# Altium schematic sheet ESP.SchDoc: Płytka rozwojowa STM
size A4; Author1: Łukasz Wawrzyniak; Organization: Politechnika Łódzka; Address1: WEEIA; Address2: Elektronika i Telekomunikacja; Address3: Semestr zimowy 2021/2022; Address4: Stopień II; Revision: -; SheetNumber: 6; SheetTotal: 7; Author2: Mateusz Melka; Title2: Zaawansowane narzędzia CAD/EDA; Author5: Maciej Figiel; Author4: Michał Skurpel; Author3: Jakub Korzeniowski; Index1: 239499; Index2: 239488; Index3: 239436; Index4: 239457; Index5: 239473
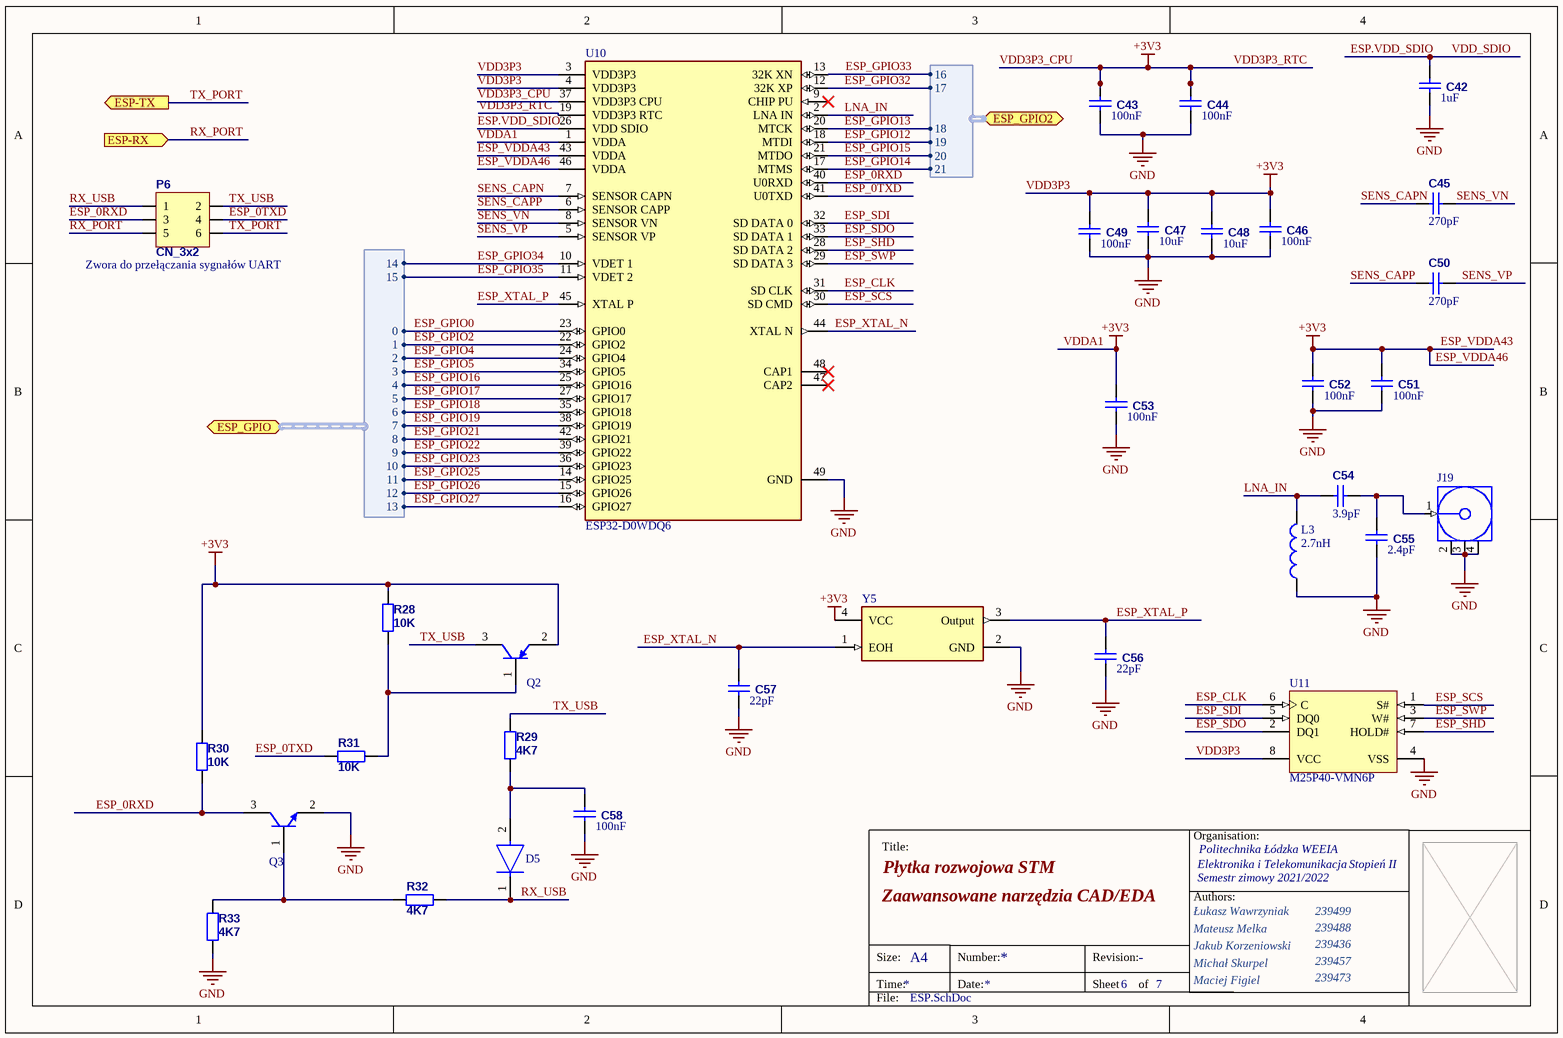
[diagram p0: ESP.SchDoc]

## Parts
C42  1uF  [0805]
C43  100nF  [0805]
C44  100nF  [0805]
C45  270pF  [0805]
C46  100nF  [0805]
C47  10uF  [0805]
C48  10uF  [0805]
C49  100nF  [0805]
C50  270pF  [0805]
C51  100nF  [0805]
C52  100nF  [0805]
C53  100nF  [0805]
C54  3.9pF  [0805]
C55  2.4pF  [0805]
C56  22pF  [0805]
C57  22pF  [0805]
C58  100nF  [0805]
D5  TME@1N4148WS  [FP-477AB-IPC_C]  (value not drawn)
J19  TME@908-22101T  [AMPH-908-22101_V]  (value not drawn)
L3  value 2.7nH  [0402-A]  (hidden comment: TME@0402AS-2N7K-08)
P6  CN_3x2  [GP_3x2]
Q2  TME@2SA1774G  [ONSC-SC-75-3-463-01_V]  (value not drawn)
Q3  TME@BC847ALT1G  [ONSC-SOT-23-3-318-08_V]  (value not drawn)
R28  10K  [0805]
R29  4K7  [0805]
R30  10K  [0805]
R31  10K  [0805]
R32  4K7  [0805]
R33  4K7  [0805]
U10  ESP32-D0WDQ6  [FP-ESP32-D0WDQ6-IPC_C]
U11  M25P40-VMN6P  [MICT-MN-8_N]
Y5  625L3C040M00000  [FP-625-MFG]  (value not drawn)

## Ports
ESP-RX (in), ESP-TX (out), ESP_GPIO2 (bidir, harness GPIO ESP2), ESP_GPIO (bidir, harness GPIO ESP)

## Harnesses
GPIO ESP: 0, 1, 2, 3, 4, 5, 6, 7, 8, 9, 10, 11, 12, 13, 14, 15
GPIO ESP2: 16, 17, 18, 19, 20, 21

## Nets
ESP_VDDA43: C43.2 C44.2 C46.2 C47.2 C48.2 C49.2 C51.2 C52.2 C53.2 Q2.2(E) R28.1 R30.1 U10.1(VDDA) U10.3(VDD3P3) U10.4(VDD3P3) U10.19(VDD3P3_RTC) U10.37(VDD3P3_CPU) U10.43(VDDA) U10.46(VDDA) U11.8(VCC) Y5.4(VCC)  [also labelled +3V3, ESP_VDDA46, VDD3P3, VDD3P3_CPU, VDD3P3_RTC, VDDA1]
GND: C42.1 C43.1 C44.1 C46.1 C47.1 C48.1 C49.1 C51.1 C52.1 C53.1 C55.1 C56.1 C57.1 C58.1 J19.2(GND) J19.3(GND) J19.4(GND) L3.1 Q3.2(E) R33.2 U10.49(GND) U11.4(VSS) Y5.2(GND)
ESP.VDD_SDIO: C42.2 U10.26(VDD_SDIO)  [also labelled VDD_SDIO]
ESP_0RXD: P6.3 Q3.3(C) R30.2 U10.40(U0RXD)
ESP_0TXD: P6.4 R31.1 U10.41(U0TXD)
ESP_CLK: U10.31(SD_CLK) U11.6(C)
ESP_GPIO0: U10.23(GPIO0) ; port ESP_GPIO.0
ESP_GPIO2: U10.22(GPIO2) ; port ESP_GPIO.1
ESP_GPIO4: U10.24(GPIO4) ; port ESP_GPIO.2
ESP_GPIO5: U10.34(GPIO5) ; port ESP_GPIO.3
ESP_GPIO12: U10.18(MTDI) ; port ESP_GPIO2.19
ESP_GPIO13: U10.20(MTCK) ; port ESP_GPIO2.18
ESP_GPIO14: U10.17(MTMS) ; port ESP_GPIO2.21
ESP_GPIO15: U10.21(MTDO) ; port ESP_GPIO2.20
ESP_GPIO16: U10.25(GPIO16) ; port ESP_GPIO.4
ESP_GPIO17: U10.27(GPIO17) ; port ESP_GPIO.5
ESP_GPIO18: U10.35(GPIO18) ; port ESP_GPIO.6
ESP_GPIO19: U10.38(GPIO19) ; port ESP_GPIO.7
ESP_GPIO21: U10.42(GPIO21) ; port ESP_GPIO.8
ESP_GPIO22: U10.39(GPIO22) ; port ESP_GPIO.9
ESP_GPIO23: U10.36(GPIO23) ; port ESP_GPIO.10
ESP_GPIO25: U10.14(GPIO25) ; port ESP_GPIO.11
ESP_GPIO26: U10.15(GPIO26) ; port ESP_GPIO.12
ESP_GPIO27: U10.16(GPIO27) ; port ESP_GPIO.13
ESP_GPIO32: U10.12(32K_XP) ; port ESP_GPIO2.17
ESP_GPIO33: U10.13(32K_XN) ; port ESP_GPIO2.16
ESP_GPIO34: U10.10(VDET_1) ; port ESP_GPIO.14
ESP_GPIO35: U10.11(VDET_2) ; port ESP_GPIO.15
ESP_SCS: U10.30(SD_CMD) U11.1(S#)
ESP_SDI: U10.32(SD_DATA_0) U11.5(DQ0)
ESP_SDO: U10.33(SD_DATA_1) U11.2(DQ1)
ESP_SHD: U10.28(SD_DATA_2) U11.7(HOLD#)
ESP_SWP: U10.29(SD_DATA_3) U11.3(W#)
ESP_XTAL_N: C57.2 U10.44(XTAL_N) Y5.1(EOH)
ESP_XTAL_P: C56.2 U10.45(XTAL_P) Y5.3(Output)
LNA_IN: C54.2 L3.2 U10.2(LNA_IN)
RX_PORT: P6.5 ; port ESP-RX
RX_USB: D5.1(C) P6.1 R32.2
SENS_CAPN: C45.2 U10.7(SENSOR_CAPN)
SENS_CAPP: C50.2 U10.6(SENSOR_CAPP)
SENS_VN: C45.1 U10.8(SENSOR_VN)
SENS_VP: C50.1 U10.5(SENSOR_VP)
TX_PORT: P6.6 ; port ESP-TX
TX_USB: P6.2 Q2.3(C) R29.1
NetC54_1: C54.1 C55.2 J19.1(SIGNAL)
NetC58_2: C58.2 D5.2(A) R29.2
NetQ2_1: Q2.1(B) R28.2 R31.2
NetQ3_1: Q3.1(B) R32.1 R33.1

Not connected (* = marked no-connect by the designer): U10 9(CHIP_PU)* 47(CAP2)* 48(CAP1)*

## Notes on the sheet
- (near P6) Zwora do przełączania sygnałów UART
- Title:
- Organisation:
- Authors:
- Size:
- Time:
- A4
- Number:
- Date:
- Revision:
- Sheet
- of
- File:

## Library data of the parts
C42 C45 C47 C48 C50 C54-C57 = Cap: Ceramic capacitor MLCC SMD ±1%; Value: 100nF; ComponentLink1Description: datasheet; ComponentLink2Description: supplier
C43 C44 C46 C49 C51-C53 C58 = Cap: Ceramic capacitor MLCC SMD ±1%; ComponentLink1Description: datasheet; ComponentLink2Description: supplier; Value: 100nF
D5 = CMP-07163-000040-1: DIODE GEN PURP 75V 150MA SOD323F; Forward Voltage: 1V; Power Dissipation: 200mW; Element Configuration: Single; Max Forward Surge Current (Ifsm): 2A; Peak Reverse Current: 5uA; Recovery Time: 4ns; Package Quantity: 1; Number of Pins: 2; Height: 1mm; REACH SVHC: No SVHC; Max Reverse Voltage (DC): 75V; Forward Current: 150mA; Length: 1.8mm; Max Repetitive Reverse Voltage (Vrrm): 75V; Max Operating Temperature: 150°C; Average Rectified Current: 150mA; Contact Plating: Tin; Packaging: Tape and Reel; Radiation Hardening: No; Min Operating Temperature: -55°C; Width: 1.35mm; Weight: 0.0276g; Lead Free: Lead Free; Mount: Surface Mount; Reverse Voltage: 75V; Reverse Recovery Time: 4ns; ComponentLink1Description: TME; ComponentLink1URL: https://www.tme.eu/en/details/1n4148ws/smd-universal-diodes/onsemi/
J19 = CMP-2000-05707-1: Female MMCX Connector, 1 Position, Height 3.607 mm, -40 to 90 degC, RoHS, Bulk; Manufacturer: Amphenol; Impedance: 50Ohm; Body Material: BerylliumCopper; Shield Termination: Solder; Body Finish: Gold; Frequency - Max: 6GHz; Connector Type: Jack,FemaleSocket; Other Names: 90822101ARF1724; Dielectric Material: LiquidCrystalPolymer(LCP); Online Catalog: MMCX,MicroMate™Series; 3D Model: 908-22101.igs; Fastening Type: Snap-On; Connector Style: MMCX; Standard Package: 1; Manufacturer URL: http://www.amphenol.com/; Series: MicroMate™; Mounting Type: SurfaceMount; Housing Color: Black; Operating Temperature: -55°C~155°C; Package Reference: 908-22101; Packaging: Bulk; Voltage Rating: -; Cable Group: -; Features: -; Datasheet URL: http://www.amphenolrf.com/downloads/dl/file/id/2664/product/2399/908_22101_customer_drawing.pdf; Center Contact Material: BerylliumCopper; Package Description: Female MMCX Connector, 1 Position, Height 3.607 mm; Center Contact Plating: Gold; Category: Connectors,Interconnects; Mounting Technology: SurfaceMount; Contact Termination: Solder; Ingress Protection: -; Datasheet Version: Rev. A, 05/1997; Family: CoaxialConnectors(RF); ComponentLink1Description: TME; ComponentLink1URL: https://www.tme.eu/pl/details/908-22101t/zlacza-mcx-mmcx/amphenol-icc/
L3 = Inductor: 0402; Code_IEC: 1005; Published: 8-Jun-2000; LatestRevisionDate: 29-May-2009; LatestRevisionNote: IPC-7351 Footprint Added.; PackageReference: 0402-A; Publisher: Altium Limited; PackageDescription: Chip Inductor; Code_JEITA: 0402; ComponentLink1Description: New link; ComponentLink1URL: https://www.tme.eu/pl/details/0402as-2n7k-08/dlawiki-smd-0402/fastron/
Q2 = CMP-1048-00415-1: PNP Silicon General Purpose Amplifier Transistor, 3-Pin SC-75, Pb-Free, Tape and Reel; Manufacturer: On Semiconductor; IC Continuous (A): -0.1; ComponentLink2URL: http://www.onsemi.com/pub_link/Collateral/2SA1774-D.PDF; Mounting Technology: Surface Mount; PartNumber: 2SA1774G; ComponentLink2Description: Datasheet; PackageDescription: 3-Pin Small Outline Transistor, Body 1.6 x 0.8 mm, Pitch 0.5 mm; RoHS: TRUE; Packing: Tape and Reel; PackageVersion: Rev. F, 07/2005; ComponentLink1URL: http://www.onsemi.com/; ComponentLink3Description: Package Specification; ComponentLink3URL: http://www.onsemi.com/pub_link/Collateral/463-01.PDF; ComponentLink1Description: Manufacturer URL; Polarity: PNP; DatasheetVersion: Rev. 9; PackageReference: SC-75-3-463-01; ComponentLink4Description: TME; ComponentLink4URL: https://www.tme.eu/en/details/2sa1774g/pnp-smd-transistors/onsemi/
Q3 = CMP-1048-00763-1: General Purpose Transistor, NPN Silicon, 3-Pin SOT-23, Pb-Free, Tape and Reel; Manufacturer: On Semiconductor; IC Continuous (A): 0.1; fT Min (MHz): 100; Mounting Technology: Surface Mount; ComponentLink1Description: Manufacturer URL; PackageDescription: 3-Pin Small Outline Transistor, Body 2.92 x 1.3 mm, Pitch 0.95 mm; PartNumber: BC847ALT1G; PackageVersion: Rev. AP, 11/2009; ComponentLink3Description: Package Specification; DatasheetVersion: Rev. 11; ComponentLink1URL: http://www.onsemi.com/; PackageReference: SOT-23-3-318-08; ComponentLink2Description: Datasheet; Packing: Tape and Reel; Polarity: NPN; ComponentLink3URL: http://www.onsemi.cn/pub_link/Collateral/318-08.PDF; RoHS: TRUE; ComponentLink2URL: http://www.onsemi.cn/pub_link/Collateral/BC846ALT1-D.PDF; ComponentLink4Description: TME; ComponentLink4URL: https://www.tme.eu/en/details/bc847alt1g/npn-smd-transistors/onsemi/
R28-R33 = Res: Resistor SMD  ±5%; Published: 19-Feb-2006; ComponentLink1Description: datasheet; ComponentLink2Description: supplier
  R28 R30 R31: Value: 10K
  R29 R32 R33: Value: 4K7
U10 = CMP-194065-000007-1: IC RF TXRX+MCU BLUETOOTH 48VFQFN; Memory Size: 520KB; Current - Receiving: 100mA; Current - Transmitting: 240mA; Interface: I2C; Sensitivity: -98dBm; Frequency: 2.4GHz; Data Rate: 150Mbps; Number of GPIO: 34; Min Operating Temperature: -40°C; Max Operating Temperature: 125°C; Packaging: Tape and Reel
U11 = CMP-0357-00072-1: 4 Mb (x1) Serial NOR Flash Memory, 75 MHz, 2.3 to 3.6 V, 8-pin SO8 Narrow (MN), Tube; Manufacturer: Micron; Part Family: M25PÂ; Speed: 75 MHzÂ; Density: 4MbÂ; Voltage: 2.3V-3.6VÂ; PackageDescription: 8-Pin SO Narrow, 3.9 X 4.9 mm, Pitch 1.27 mm; ComponentLink2URL: http://www.micron.com/~/media/Documents/Products/Data%20Sheet/NOR%20Flash/Serial%20NOR/M25P/M25P40.pdf; Part Status: ProductionÂ; Package: SO8 NarrowÂ; RoHS: YesÂ; PackageReference: MICT-MN-8; Mounting Technology: Surface Mount; Type: Data StorageÂ; DatasheetVersion: Rev. Y; ComponentLink2Description: Datasheet; PartNumber: M25P40-VMN6P; Width: x1Â; ComponentLink1URL: http://www.micron.com/; ComponentLink3Description: Package Specification; Applications: EmbeddedÂ; ComponentLink1Description: Manufacturer URL; PackageVersion: Rev 11; ComponentLink3URL: http://www.micron.com/~/media/Documents/Products/Data%20Sheet/NOR%20Flash/Serial%20NOR/M25P/M25P05A.pdf
Y5 = CMP-06858-000003-1: XTAL OSC XO 40.0000MHZ CMOS SMD; Max Supply Current: 15mA; Frequency: 40MHz; Frequency Stability: 50ppm; Min Supply Voltage: 2.97V; Max Supply Voltage: 3.63V; Load Capacitance: 15pF; Operating Supply Voltage: 3.3V; Min Operating Temperature: -10°C; Length: 2.5mm; Radiation Hardening: No; Max Operating Temperature: 70°C; Depth: 2mm; Mount: Surface Mount; Height: 0.039inch; Packaging: Tape and Reel; Case/Package: CSMD; Termination: SMD/SMT; Package Quantity: 3000; Contact Plating: Gold; Width: 0.079inch